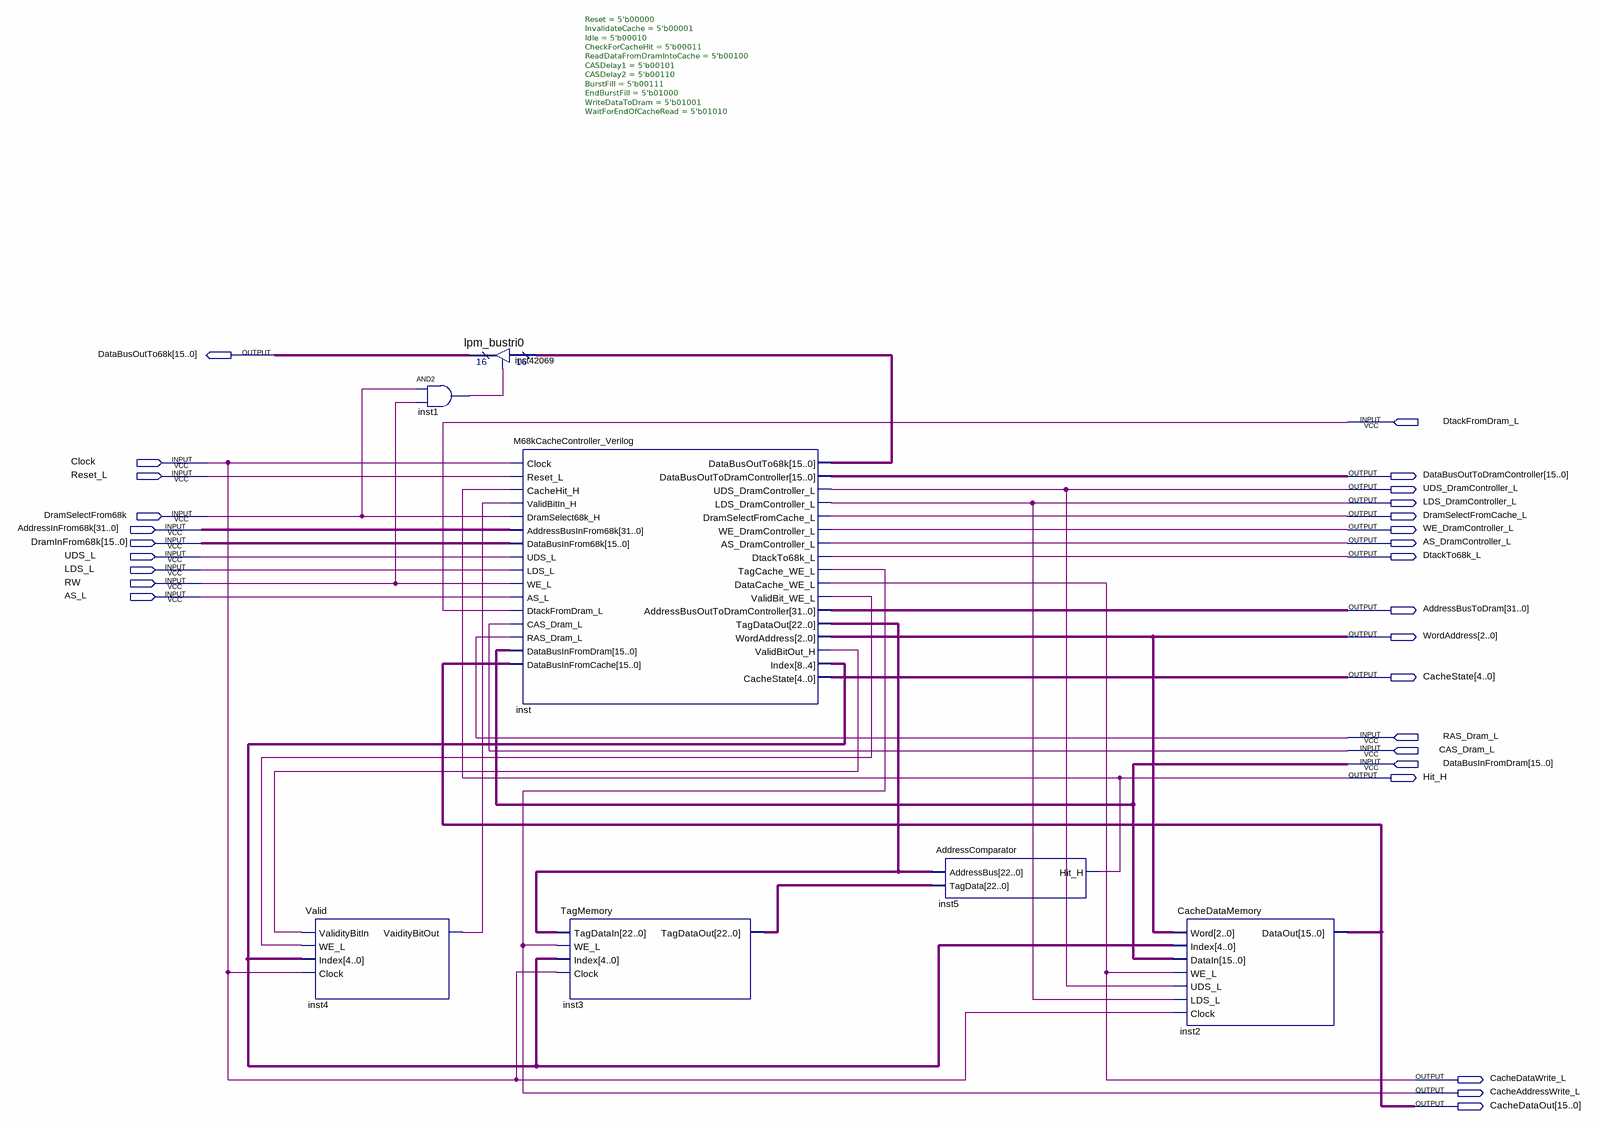
[diagram p0: schematic sheet]
// Quartus schematic DramCache.bdf as structural Verilog: 7 symbols, 28 pins
module DramCache (
  input  DtackFromDram_L,
  input  Clock,
  input  Reset_L,
  input  DramSelectFrom68k,
  input  [31:0] AddressInFrom68k,
  input  [15:0] DramInFrom68k,
  input  UDS_L,
  input  LDS_L,
  input  RW,
  input  AS_L,
  input  RAS_Dram_L,
  input  CAS_Dram_L,
  input  [15:0] DataBusInFromDram,
  output [15:0] DataBusOutTo68k,
  output [15:0] DataBusOutToDramController,
  output UDS_DramController_L,
  output LDS_DramController_L,
  output DramSelectFromCache_L,
  output WE_DramController_L,
  output AS_DramController_L,
  output DtackTo68k_L,
  output [31:0] AddressBusToDram,
  output [2:0] WordAddress,
  output [4:0] CacheState,
  output Hit_H,
  output CacheDataWrite_L,
  output CacheAddressWrite_L,
  output [15:0] CacheDataOut
);

  wire inst1_out, inst4_vaiditybitout, inst_validbit_we_l, inst_validbitout_h;
  wire [4:0] inst_index;
  wire [15:0] inst_databusoutto68k;
  wire [22:0] inst3_tagdataout, inst_tagdataout;

  Valid inst4 (
    .ValidityBitIn(inst_validbitout_h), .WE_L(inst_validbit_we_l), .Index(inst_index), .Clock(Clock),
    .VaidityBitOut(inst4_vaiditybitout));
  and inst1 (inst1_out, DramSelectFrom68k, RW);
  lpm_bustri0 inst42069 (.enabledt(inst1_out), .data(inst_databusoutto68k), .tridata(DataBusOutTo68k));
  M68kCacheController_Verilog #(.Reset(5'b00000), .InvalidateCache(5'b00001), .Idle(5'b00010), .CheckForCacheHit(5'b00011), .ReadDataFromDramIntoCache(5'b00100), .CASDelay1(5'b00101), .CASDelay2(5'b00110), .BurstFill(5'b00111), .EndBurstFill(5'b01000), .WriteDataToDram(5'b01001), .WaitForEndOfCacheRead(5'b01010)) inst (
    .Clock(Clock), .Reset_L(Reset_L), .CacheHit_H(Hit_H), .ValidBitIn_H(inst4_vaiditybitout),
    .DramSelect68k_H(DramSelectFrom68k), .AddressBusInFrom68k(AddressInFrom68k),
    .DataBusInFrom68k(DramInFrom68k), .UDS_L(UDS_L), .LDS_L(LDS_L), .WE_L(RW), .AS_L(AS_L),
    .DtackFromDram_L(DtackFromDram_L), .CAS_Dram_L(CAS_Dram_L), .RAS_Dram_L(RAS_Dram_L),
    .DataBusInFromDram(DataBusInFromDram), .DataBusInFromCache(CacheDataOut),
    .DataBusOutTo68k(inst_databusoutto68k), .DataBusOutToDramController(DataBusOutToDramController),
    .UDS_DramController_L(UDS_DramController_L), .LDS_DramController_L(LDS_DramController_L),
    .DramSelectFromCache_L(DramSelectFromCache_L), .WE_DramController_L(WE_DramController_L),
    .AS_DramController_L(AS_DramController_L), .DtackTo68k_L(DtackTo68k_L),
    .TagCache_WE_L(CacheAddressWrite_L), .DataCache_WE_L(CacheDataWrite_L),
    .ValidBit_WE_L(inst_validbit_we_l), .AddressBusOutToDramController(AddressBusToDram),
    .TagDataOut(inst_tagdataout), .WordAddress(WordAddress), .ValidBitOut_H(inst_validbitout_h),
    .Index(inst_index), .CacheState(CacheState));
  TagMemory inst3 (
    .TagDataIn(inst_tagdataout), .WE_L(CacheAddressWrite_L), .Index(inst_index), .Clock(Clock),
    .TagDataOut(inst3_tagdataout));
  AddressComparator inst5 (.AddressBus(inst_tagdataout), .TagData(inst3_tagdataout), .Hit_H(Hit_H));
  CacheDataMemory inst2 (
    .Word(WordAddress), .Index(inst_index), .DataIn(DataBusInFromDram), .WE_L(CacheDataWrite_L),
    .UDS_L(UDS_DramController_L), .LDS_L(LDS_DramController_L), .Clock(Clock), .DataOut(CacheDataOut));
endmodule
